# EAGLE design 601_motor (EAGLE 8.0.0)
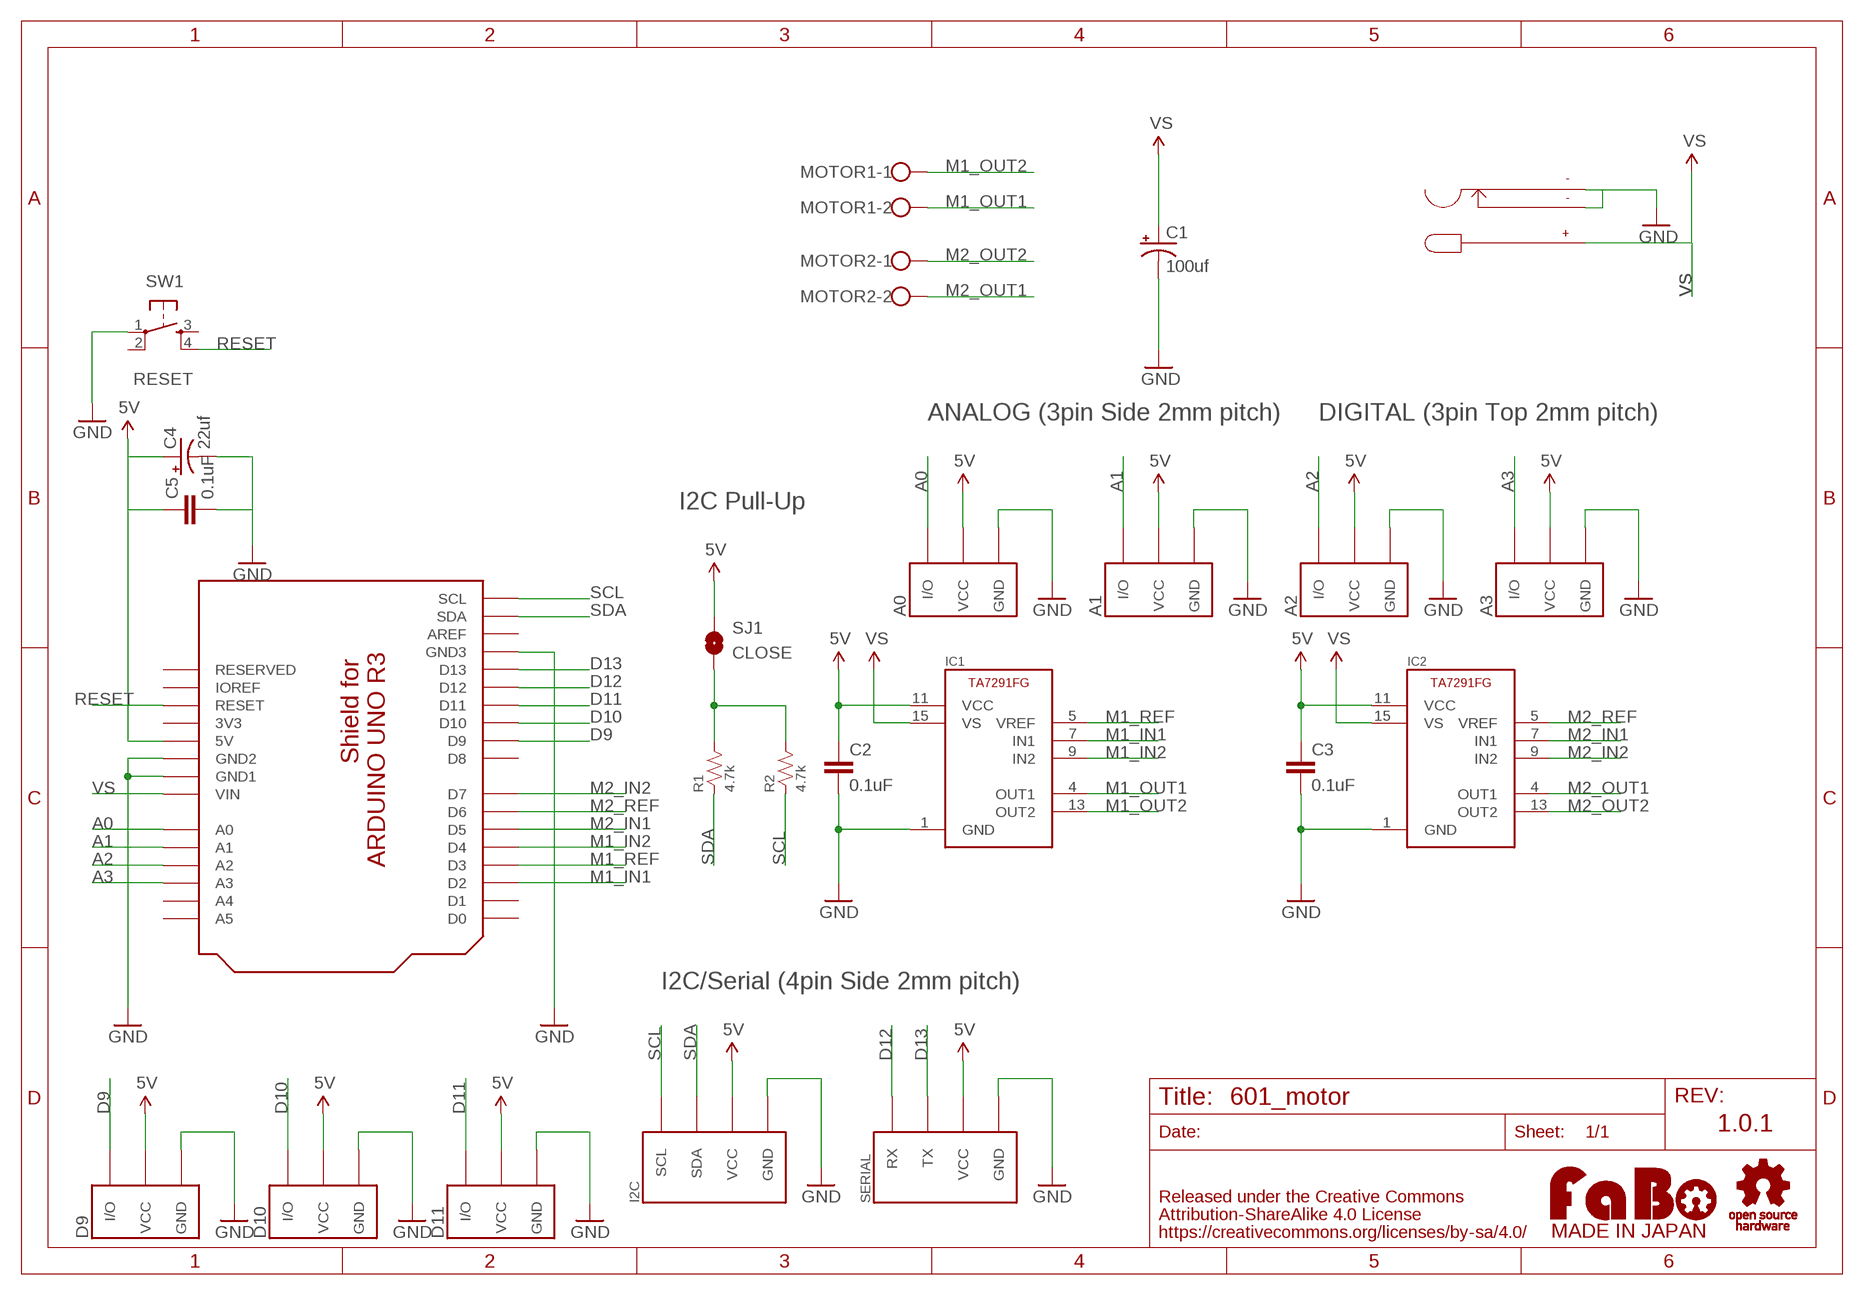
[diagram p0: schematic, sheet 1]

## Parts
A0  FABO_BRICK_3PIN-S03B-PASK-2  [FABO_BRICK_3PIN_S03B-PASK-2]
A1  FABO_BRICK_3PIN-S03B-PASK-2  [FABO_BRICK_3PIN_S03B-PASK-2]
A2  FABO_BRICK_3PIN-S03B-PASK-2  [FABO_BRICK_3PIN_S03B-PASK-2]
A3  FABO_BRICK_3PIN-S03B-PASK-2  [FABO_BRICK_3PIN_S03B-PASK-2]
C1  100uf  CPOL-US153CLV-0405  [153CLV-0405]
C2  0.1uF  CAP-EIA0603  [EIA0603]
C3  0.1uF  CAP-EIA0603  [EIA0603]
C4  22uf  CPOL-US153CLV-0405  [153CLV-0405]
C5  0.1uF  CAP-EIA0603  [EIA0603]
D9  FABO_BRICK_3PIN-HEADER  [FABO_BRICK_3PIN_HEADER]
D10  FABO_BRICK_3PIN-HEADER  [FABO_BRICK_3PIN_HEADER]
D11  FABO_BRICK_3PIN-HEADER  [FABO_BRICK_3PIN_HEADER]
I2C  FABO_BRICK_I2C-S04B-PASK-2  [FABO_BRICK_I2C_S04B-PASK-2]
IC1  MOTOR-DRIVER-TA7291FG  [MOTOR-DRIVER-TA7291FG]
IC2  MOTOR-DRIVER-TA7291FG  [MOTOR-DRIVER-TA7291FG]
MOTOR1  W237-102  [W237-102]
MOTOR2  W237-102  [W237-102]
R1  4.7k  RESISTOR-0603  [0603]
R2  4.7k  RESISTOR-0603  [0603]
SERIAL  FABO_BRICK_SERIAL-S04B-PASK-2  [FABO_BRICK_SERIAL_S04B-PASK-2]
SJ1  CLOSE  SMD-JUMPER-2-CLOSE  [SMD-JUMPER-2-CLOSE]
SW1  RESET  SWITCH-TACT-6MM  [DTS_6_V]
U1  ARDUINO_UNO_R3_SHIELD-NOLABEL  [ARDUINO_UNO_R3_NOLABEL]
U$2  DCJACK-MJ179PH  [MJ179PH]
U$6  LOGO_OSHW-T_M  [LOGO_OSHW_T_MS]
U$7  LOGO_FABO-M  [LOGO_FABO_MS]

## Nets
5V: A0.VCC A1.VCC A2.VCC A3.VCC C2.1 C3.1 C4.+ C5.1 D9.VCC D10.VCC D11.VCC I2C.VCC IC1.11(VCC) IC2.11(VCC) SERIAL.VCC SJ1.1 U1.5V
A0: A0.I/O U1.A0
A1: A1.I/O U1.A1
A2: A2.I/O U1.A2
A3: A3.I/O U1.A3
D9: D9.I/O U1.D9
D10: D10.I/O U1.D10
D11: D11.I/O U1.D11
D12: SERIAL.RX U1.D12
D13: SERIAL.TX U1.D13
GND: A0.GND A1.GND A2.GND A3.GND C1.- C2.2 C3.2 C4.- C5.2 D9.GND D10.GND D11.GND I2C.GND IC1.1(GND) IC2.1(GND) SERIAL.GND SW1.1 U1.GND1 U1.GND2 U1.GND3 U$2.-@1(-) U$2.-@2(-)
M1_IN1: IC1.7(IN1) U1.D2
M1_IN2: IC1.9(IN2) U1.D4
M1_OUT1: IC1.4(OUT1) MOTOR1.2
M1_OUT2: IC1.13(OUT2) MOTOR1.1
M1_REF: IC1.5(VREF) U1.D3
M2_IN1: IC2.7(IN1) U1.D5
M2_IN2: IC2.9(IN2) U1.D7
M2_OUT1: IC2.4(OUT1) MOTOR2.2
M2_OUT2: IC2.13(OUT2) MOTOR2.1
M2_REF: IC2.5(VREF) U1.D6
N$1: R1.2 R2.2 SJ1.2
RESET: SW1.4 U1.RESET
SCL: I2C.SCL R2.1 U1.SCL
SDA: I2C.SDA R1.1 U1.SDA
VS: C1.+ IC1.15(VS) IC2.15(VS) U1.VIN U$2.+
Unconnected: SW1.2 SW1.3 U1.A4 U1.A5 U1.AREF U1.D0 U1.D1 U1.D8 U1.IOREF U1.RESERVED

## Notes on the sheet
- ANALOG (3pin Side 2mm pitch) | DIGITAL (3pin Top 2mm pitch)
- I2C Pull-Up
- I2C/Serial (4pin Side 2mm pitch)
- 1.0.1

## Power pins joined to a net without a drawn wire
3V3: U1.3V3

## Library data of the parts
A0 A1-A3 D9-D11 = FaBo-Template:FABO_BRICK_3PIN: FaBo Brick 3pin
C1 C4 = resistor:CPOL-US: POLARIZED CAPACITOR, American symbol
C2 C3 C5 = FaBo-etc:CAP: Capacitor Standard 0603 ceramic capacitor
I2C = FaBo-Template:FABO_BRICK_I2C: FaBo Brick I2C
IC1 IC2 = FaBo-etc:MOTOR-DRIVER-TA7291FG
MOTOR1 MOTOR2 = con-wago-500:W237-102: WAGO SCREW CLAMP; MPN: 237-102; OC_FARNELL: unknown; OC_NEWARK: 70K9898
R1 R2 = FaBo-Resistors:RESISTOR: RESISTOR
SERIAL = FaBo-Template:FABO_BRICK_SERIAL: FaBo Brick Serial
SJ1 = FaBo-Supply:SMD-JUMPER-2
SW1 = FaBo-etc:SWITCH-TACT
U1 = FaBo-Boards:ARDUINO_UNO_R3_SHIELD
U$2 = FaBo-Supply:DCJACK-MJ179PH
U$6 = FaBo-etc:LOGO_OSHW
U$7 = FaBo-etc:LOGO_FABO

## Board
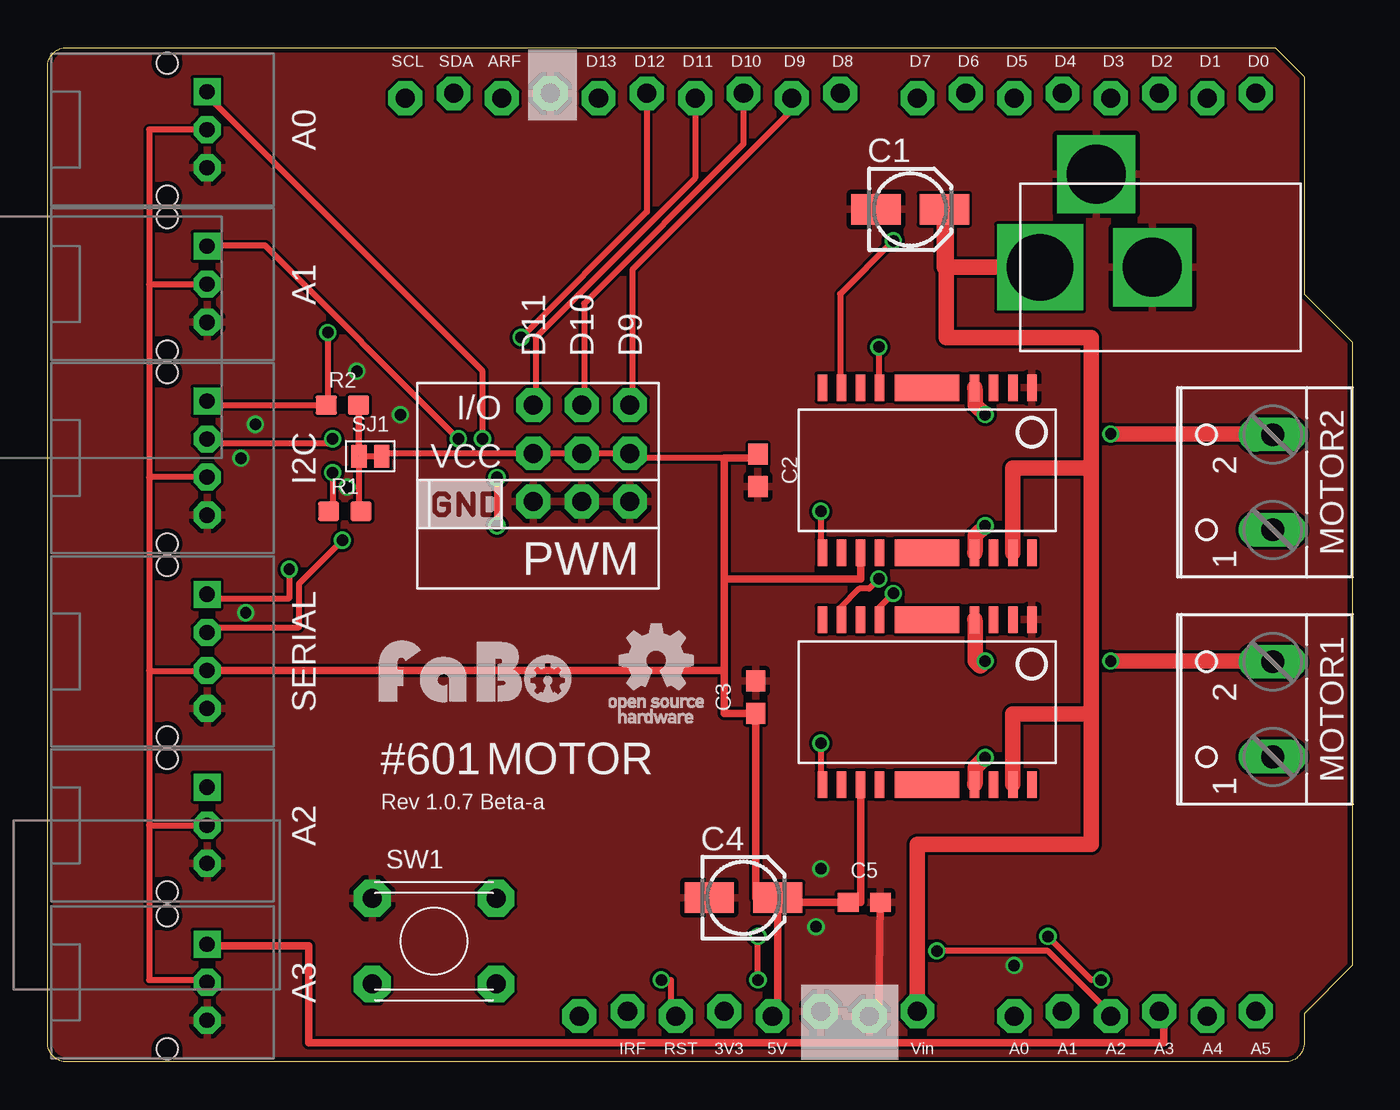
[diagram p1: board, top side]
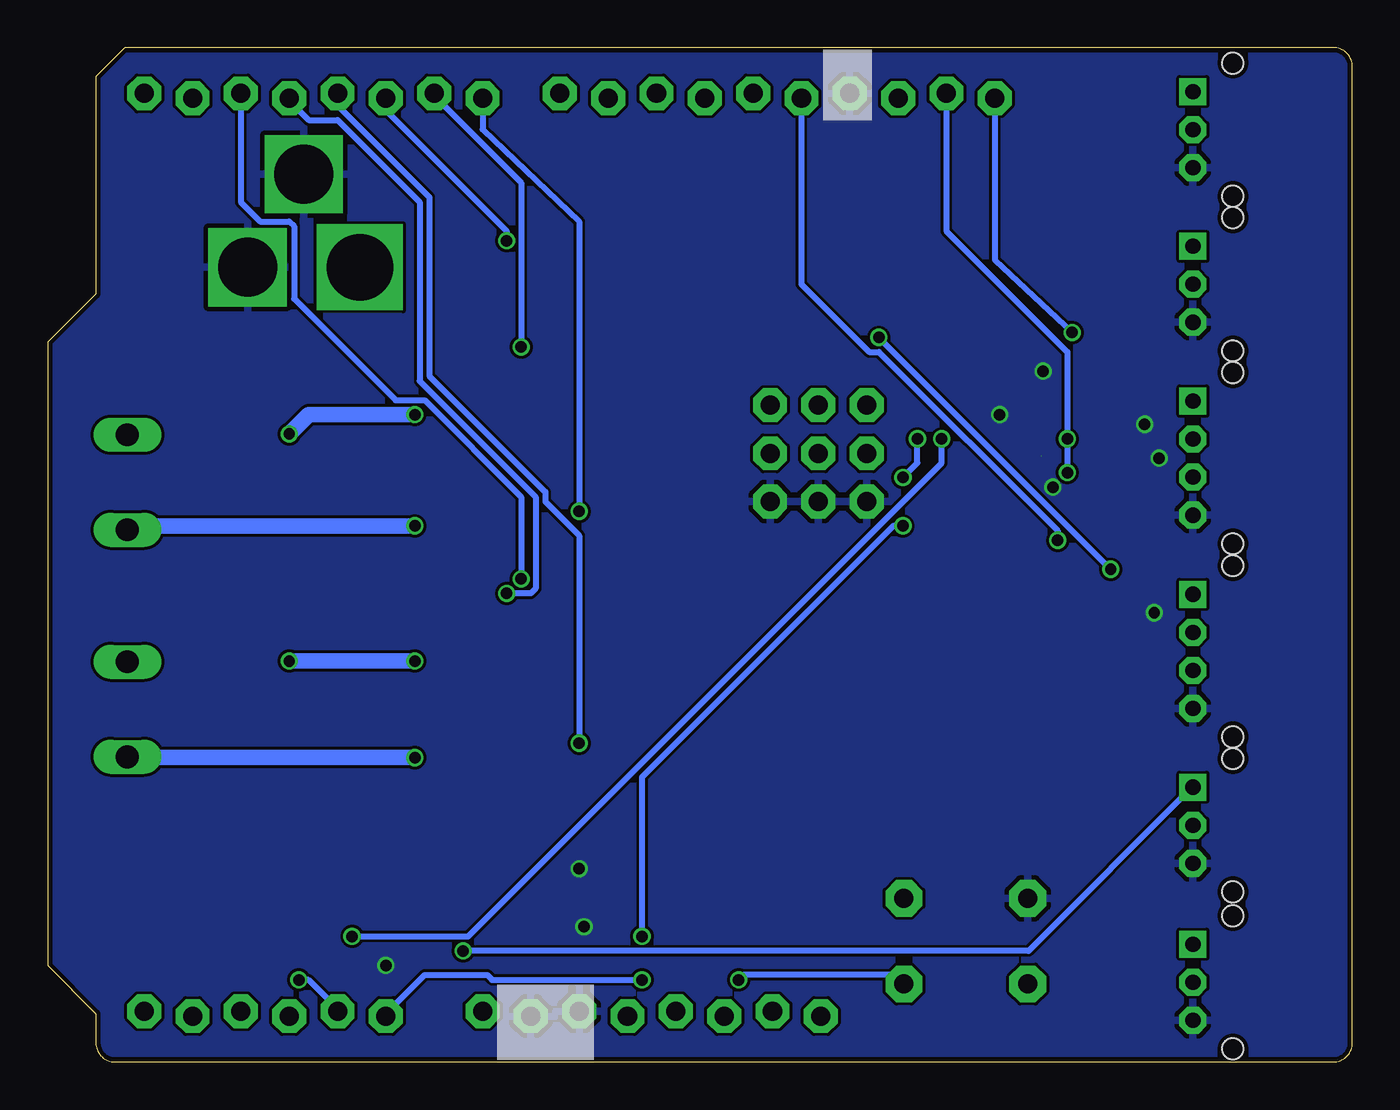
[diagram p2: board, bottom side, seen from below]

Size 68.58 x 53.34 mm. Coordinates in mm from the lower left corner, seen from the top.
Copper layers (1*16): Top 0.035mm / dielectric 1.5mm / Bottom 0.035mm
Design rules "SeeedStudio_2layer_DRU_no_angle_20140221": minimum track width 6mil, minimum drill 12mil, track to track 6mil, track to pad 6mil, pad to pad 6mil, via to via 6mil, smd to smd 0mil, copper to edge 10mil, drill to drill 10mil, minimum pad ring 10mil, minimum via ring 6mil, stop-mask expansion 2mil, vias tented up to drill 100mil, thermal gap 10mil

### Footprints (pad centres in the part's own frame; a part is rotated, then mirrored left to right if it is on the bottom)
FABO_BRICK_3PIN_S03B-PASK-2 = drill 0.8 pad 1.422 octagon: GND -2,0; VCC 0,0 | drill 0.8 pad 1.422 square: I/O 2,0 | hole 1.1: 3.5,2.1; -3.5,2.1
153CLV-0405 = smd 2.6 x 1.6: + 1.8,0; - -1.8,0
EIA0603 = smd 1.1 x 1: 1 -0.85,0; 2 0.85,0
FABO_BRICK_3PIN_HEADER = drill 1 pad 1.778 octagon: GND -2.54,0; I/O 2.54,0; VCC 0,0
FABO_BRICK_I2C_S04B-PASK-2 = drill 0.8 pad 1.422 octagon: GND -3,0; SDA 1,0; VCC -1,0 | drill 0.8 pad 1.422 square: SCL 3,0 | hole 1.1: 4.5,2.1; -4.5,2.1
MOTOR-DRIVER-TA7291FG = smd 0.5 x 1.4: 1 -5.5,-4.34; 2 -4.5,-4.34; 3 -3.5,-4.34; 4 -2.5,-4.34; 5 2.5,-4.34; 6 3.5,-4.34; 7 4.5,-4.34; 8 5.5,-4.34; 9 5.5,4.34; 10 4.5,4.34; 11 3.5,4.34; 12 2.5,4.34; 13 -2.5,4.34; 14 -3.5,4.34; 15 -4.5,4.34; 16 -5.5,4.34 | smd 3.4 x 1.4: 17 0,-4.34; 18 0,4.34
W237-102 = drill 1.194 long: 1 -2.5,-1.27; 2 2.5,-1.27
0603 = smd 1.1 x 1: 1 -0.85,0; 2 0.85,0
FABO_BRICK_SERIAL_S04B-PASK-2 = drill 0.8 pad 1.422 octagon: GND -3,0; TX 1,0; VCC -1,0 | drill 0.8 pad 1.422 square: RX 3,0 | hole 1.1: 4.5,2.1; -4.5,2.1
SMD-JUMPER-2-CLOSE = smd 0.8 x 1.2: 1 -0.6,0; 2 0.6,0
DTS_6_V = drill 1 pad 1.93 octagon: 1 -3.25,2.25; 2 3.25,2.25; 3 -3.25,-2.25; 4 3.25,-2.25
ARDUINO_UNO_R3_NOLABEL = drill 1 pad 1.778 octagon: 3V3 35.56,2.667; 5V 38.1,2.413; A0 50.8,2.413; A1 53.34,2.667; A2 55.88,2.413; A3 58.42,2.667; A4 60.96,2.413; A5 63.5,2.667; AREF 23.876,50.673; D0 63.5,50.927; D1 60.96,50.673; D2 58.42,50.927; D3 55.88,50.673; D4 53.34,50.927; D5 50.8,50.673; D6 48.26,50.927; D7 45.72,50.673; D8 41.656,50.927; D9 39.116,50.673; D10 36.576,50.927; D11 34.036,50.673; D12 31.496,50.927; D13 28.956,50.673; GND1 43.18,2.413; GND2 40.64,2.667; GND3 26.416,50.927; IOREF 30.48,2.667; RESERVED 27.94,2.413; RESET 33.02,2.413; SCL 18.796,50.673; SDA 21.336,50.927; VIN 45.72,2.667
MJ179PH = drill 3.5 square: + 2.95,0 | drill 3.1 square: -@1 -2.95,0; -@2 0,-4.9

### Placement (x,y rotation side)
A0  8.38,49.02 90 top
A1  8.38,40.89 90 top
A2  8.38,12.45 90 top
A3  8.38,4.19 90 top
C1  45.34,44.83 0 top
C2  37.34,31.11 270 top
C3  37.21,19.18 90 top
C4  36.58,8.64 0 top
C5  42.93,8.38 0 top
D9  30.61,32 90 top
D10  28.07,32 90 top
D11  25.53,32 90 top
I2C  8.38,31.75 90 top
IC1  46.23,18.92 180 top
IC2  46.23,31.11 180 top
MOTOR1  63.12,18.54 90 top
MOTOR2  63.12,30.48 90 top
R1  15.62,28.96 0 top
R2  15.49,34.54 0 top
SERIAL  8.38,21.59 90 top
SJ1  16.97,31.85 0 top
SW1  20.32,6.35 0 top
U1  0,0 0 top
U$2  55.12,41.78 180 top
U$6  32,21.08 0 top
U$7  22.48,18.54 0 top
U$19  [LOGO_SILK_GND]  20.07,28.07 0 top

### Tracks (layer width: path | path; a pad name or v marks a point on that pad's centre or on a via)
5V
  Top 0.305: 35.56,31.75 30.61,31.75 D9.VCC D10.VCC D11.VCC 17.57,32 17.57,31.85 | 8.38,30.73 I2C.VCC 5.33,30.75 | 5.33,30.75 5.33,20.57 | 5.33,20.57 8.38,20.57 SERIAL.VCC | 5.33,20.57 5.33,12.45 | 5.33,12.45 A2.VCC | 5.33,12.45 5.33,4.32 8.38,4.32 A3.VCC | 5.33,40.89 5.33,30.75 | 5.33,40.89 A1.VCC | A0.VCC 5.33,49.02 5.33,40.89
  Top 0.406: U1.5V 38.38,2.41 38.38,8.38 | 38.38,8.38 C4.+ 37.21,8.64 C3.1 35.56,18.33 35.56,20.59 | 38.38,8.38 C5.1 42.73,8.38 IC1.11 | 35.56,25.4 42.73,25.4 IC2.11 | 35.56,25.4 35.56,31.75 37.34,31.75 C2.1 | SERIAL.VCC 35.56,20.59 | 35.56,20.59 35.56,25.4
A0  (via drill 0.6)
  Top 0.305: v22.86,32.77 22.86,36.32 8.38,50.8 A0.I/O | v23.62,28.19 v23.62,30.73 | v37.34,4.32 v37.34,6.6
  Bottom 0.305: v22.86,32.77 22.86,31.5 v23.62,30.73 | v23.62,28.19 24.13,28.19 37.34,14.99 v37.34,6.6 | v37.34,4.32 45.21,4.32 45.47,4.57 48.77,4.57 50.8,2.54 U1.A0
A1  (via drill 0.6)
  Top 0.305: v21.59,32.77 11.43,42.93 8.38,42.93 A1.I/O | v52.58,6.6 54.86,4.32 v55.37,4.32
  Bottom 0.305: v21.59,32.77 21.59,31.5 46.48,6.6 v52.58,6.6 | v55.37,4.32 54.86,4.32 53.34,2.79 U1.A1
A2  (via drill 0.6)
  Top 0.305: v46.74,5.84 52.58,5.84 55.88,2.54 U1.A2
  Bottom 0.305: v46.74,5.84 17.02,5.84 8.38,14.48 A2.I/O
A3
  Top 0.406: U1.A3 58.67,2.67 58.67,1.02 13.72,1.02 13.72,6.1 8.38,6.1 A3.I/O
D9
  Top 0.305: U1.D9 39.12,50.04 30.73,41.66 30.73,34.54 D9.I/O
D10
  Top 0.305: U1.D10 36.58,48.26 28.19,39.88 28.19,34.54 D10.I/O
D11
  Top 0.305: U1.D11 34.04,46.48 25.65,38.1 25.65,34.54 D11.I/O
D12  (via drill 0.6)
  Top 0.305: v12.7,25.91 12.7,24.38 8.38,24.38 SERIAL.RX | v24.89,38.1 31.5,44.7 U1.D12
  Bottom 0.305: v24.89,38.1 v12.7,25.91
D13  (via drill 0.6)
  Top 0.305: v15.49,27.43 13.21,25.15 13.21,22.86 8.64,22.86 8.38,22.61 SERIAL.TX
  Bottom 0.305: v15.49,27.43 15.49,27.94 24.89,37.34 25.4,37.34 28.96,40.89 U1.D13
GND  (via drill 0.6)
  Top 0.406: C5.2 43.69,2.79 U1.GND1
  other vias: 40.64,10.16 10.92,33.53 10.16,31.75 18.54,34.04 16.26,36.32 15.75,30.23 40.39,7.11 10.41,23.62 50.8,5.08
  pour Bottom: 0,0 68.58,0 68.58,53.34 0,53.34
  pour Top: 0,0 68.58,0 68.58,53.34 0,53.34
M1_IN1  (via drill 0.6)
  Top 0.305: v43.69,25.4 43.18,24.89 42.67,24.89 41.66,23.88 41.66,23.37 IC1.7
  Bottom 0.305: v43.69,25.4 43.69,29.72 48.77,34.8 50.29,34.8 55.63,40.13 55.63,43.94 55.88,44.2 57.4,44.2 58.42,45.21 U1.D2
M1_IN2  (via drill 0.6)
  Top 0.305: v40.64,16.76 40.64,14.73 IC1.9
  Bottom 0.305: v40.64,16.76 40.64,27.69 42.42,29.46 42.42,29.97 48.51,36.07 48.51,45.47 53.34,50.29 U1.D4
M1_OUT1  (via drill 0.6)
  Top 0.813: IC1.4 48.77,23.11 48.77,21.08 49.02,20.83 v49.28,21.08 | v55.88,21.08 64.26,21.08 MOTOR1.2
  Bottom 0.813: v49.28,21.08 v55.88,21.08
M1_OUT2  (via drill 0.6)
  Top 0.813: v49.28,16 48.77,15.49 48.77,14.73 IC1.13
  Bottom 0.813: v49.28,16 64.26,16 MOTOR1.1
M1_REF  (via drill 0.6)
  Top 0.305: v44.45,24.64 43.69,23.88 43.69,23.37 IC1.5
  Bottom 0.305: v44.45,24.64 43.18,24.64 42.93,24.89 42.93,29.72 49.02,35.81 49.02,45.21 53.34,49.53 54.86,49.53 55.88,50.55 U1.D3
M2_IN1  (via drill 0.6)
  Top 0.305: v44.45,43.18 41.66,40.39 41.66,35.56 IC2.7
  Bottom 0.305: v44.45,43.18 44.45,43.69 50.8,50.04 U1.D5
M2_IN2  (via drill 0.6)
  Top 0.305: v40.64,28.96 40.64,26.92 IC2.9
  Bottom 0.305: v40.64,28.96 40.64,44.2 45.72,49.02 U1.D7
M2_OUT1  (via drill 0.6)
  Top 0.813: v55.88,33.02 64.26,33.02 MOTOR2.2 | v49.28,34.04 48.77,34.54 48.77,35.31 IC2.4
  Bottom 0.813: v55.88,33.02 54.86,34.04 v49.28,34.04
M2_OUT2  (via drill 0.6)
  Top 0.813: v49.28,28.19 48.77,27.69 48.77,26.92 IC2.13
  Bottom 0.813: v49.28,28.19 64.26,28.19 MOTOR2.1
M2_REF  (via drill 0.6)
  Top 0.305: v43.69,37.59 43.69,35.56 IC2.5
  Bottom 0.305: v43.69,37.59 43.69,46.23 48.26,50.8 U1.D6
N$1  (1 unrouted)
  Top 0.305: R1.2 16.34,28.96 16.34,31.85 | 16.34,31.85 R2.2 16.34,31.85
RESET  (via drill 0.6)
  Top 0.305: v32.26,4.32 32.77,4.32 32.77,2.79 33.02,2.54 U1.RESET
  Bottom 0.305: v32.26,4.32 32,4.57 23.88,4.57 23.62,4.32 SW1.4
SCL  (via drill 0.6)
  Top 0.305: v14.73,38.35 14.73,34.54 R2.1 8.38,34.54 I2C.SCL
  Bottom 0.305: v14.73,38.35 18.8,42.16 U1.SCL
SDA  (via drill 0.6)
  Top 0.305: v14.99,30.99 14.99,28.96 R1.1 | v14.99,32.77 14.73,32.51 8.38,32.51 I2C.SDA
  Bottom 0.305: v14.99,30.99 v14.99,32.77 14.99,37.34 21.34,43.69 U1.SDA
VS
  Top 0.813: U$2.+ 47.14,41.78 C1.+ 47.24,44.83 47.24,38.1 54.86,38.1 54.86,31.24 | 54.86,31.24 50.73,31.24 IC2.15 | 54.86,18.29 54.86,31.24 | 54.86,18.29 50.73,18.29 IC1.15 | U1.VIN 45.72,11.43 54.86,11.43 54.86,18.29

### Text on the board
tPlace: SCL | SDA | ARF | D13 | D12 | D11 | D10 | D9 | D8 | D7 | D6 | D5 | D4 | D3 | D2 | D1 | D0 | I/O | VCC | PWM | #601 | MOTOR | Rev 1.0.7 Beta-a | IRF | RST | 3V3 | 5V | Vin | A0 | A1 | A2 | A3 | A4 | A5